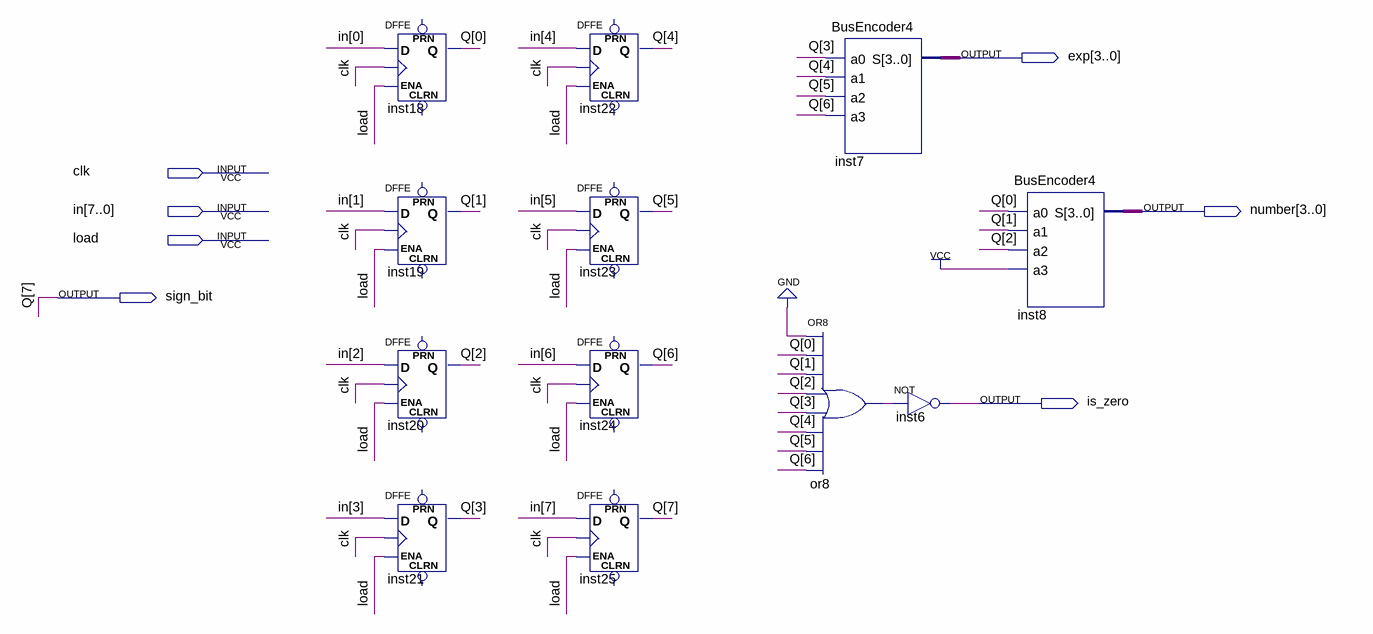
[diagram p0: schematic sheet]
// Quartus schematic R_in.bdf as structural Verilog: 12 symbols, 7 pins
module R_in (
  input  clk,
  input  [7:0] in,
  input  load,
  output [3:0] exp,
  output [3:0] number,
  output sign_bit,
  output is_zero
);

  wire or8_out;
  wire [6:0] Q;

  DFFE inst18 (.D(in[0]), .CLK(clk), .ENA(load), .Q(Q[0]));  // open: PRN, CLRN
  DFFE inst19 (.D(in[1]), .CLK(clk), .ENA(load), .Q(Q[1]));  // open: PRN, CLRN
  DFFE inst20 (.D(in[2]), .CLK(clk), .ENA(load), .Q(Q[2]));  // open: PRN, CLRN
  DFFE inst21 (.D(in[3]), .CLK(clk), .ENA(load), .Q(Q[3]));  // open: PRN, CLRN
  DFFE inst22 (.D(in[4]), .CLK(clk), .ENA(load), .Q(Q[4]));  // open: PRN, CLRN
  DFFE inst23 (.D(in[5]), .CLK(clk), .ENA(load), .Q(Q[5]));  // open: PRN, CLRN
  DFFE inst24 (.D(in[6]), .CLK(clk), .ENA(load), .Q(Q[6]));  // open: PRN, CLRN
  DFFE inst25 (.D(in[7]), .CLK(clk), .ENA(load), .Q(sign_bit));  // open: PRN, CLRN
  or or8 (or8_out, 1'b0, Q[0], Q[1], Q[2], Q[3], Q[4], Q[5], Q[6]);
  BusEncoder4 inst7 (.a0(Q[3]), .a1(Q[4]), .a2(Q[5]), .a3(Q[6]), .S(exp));
  not inst6 (is_zero, or8_out);
  BusEncoder4 inst8 (.a0(Q[0]), .a1(Q[1]), .a2(Q[2]), .a3(1'b1), .S(number));

  // Other names for the same wires on the sheet: Q[7] = sign_bit
endmodule
